# EAGLE design PICO_SDR (EAGLE 9.6.2)
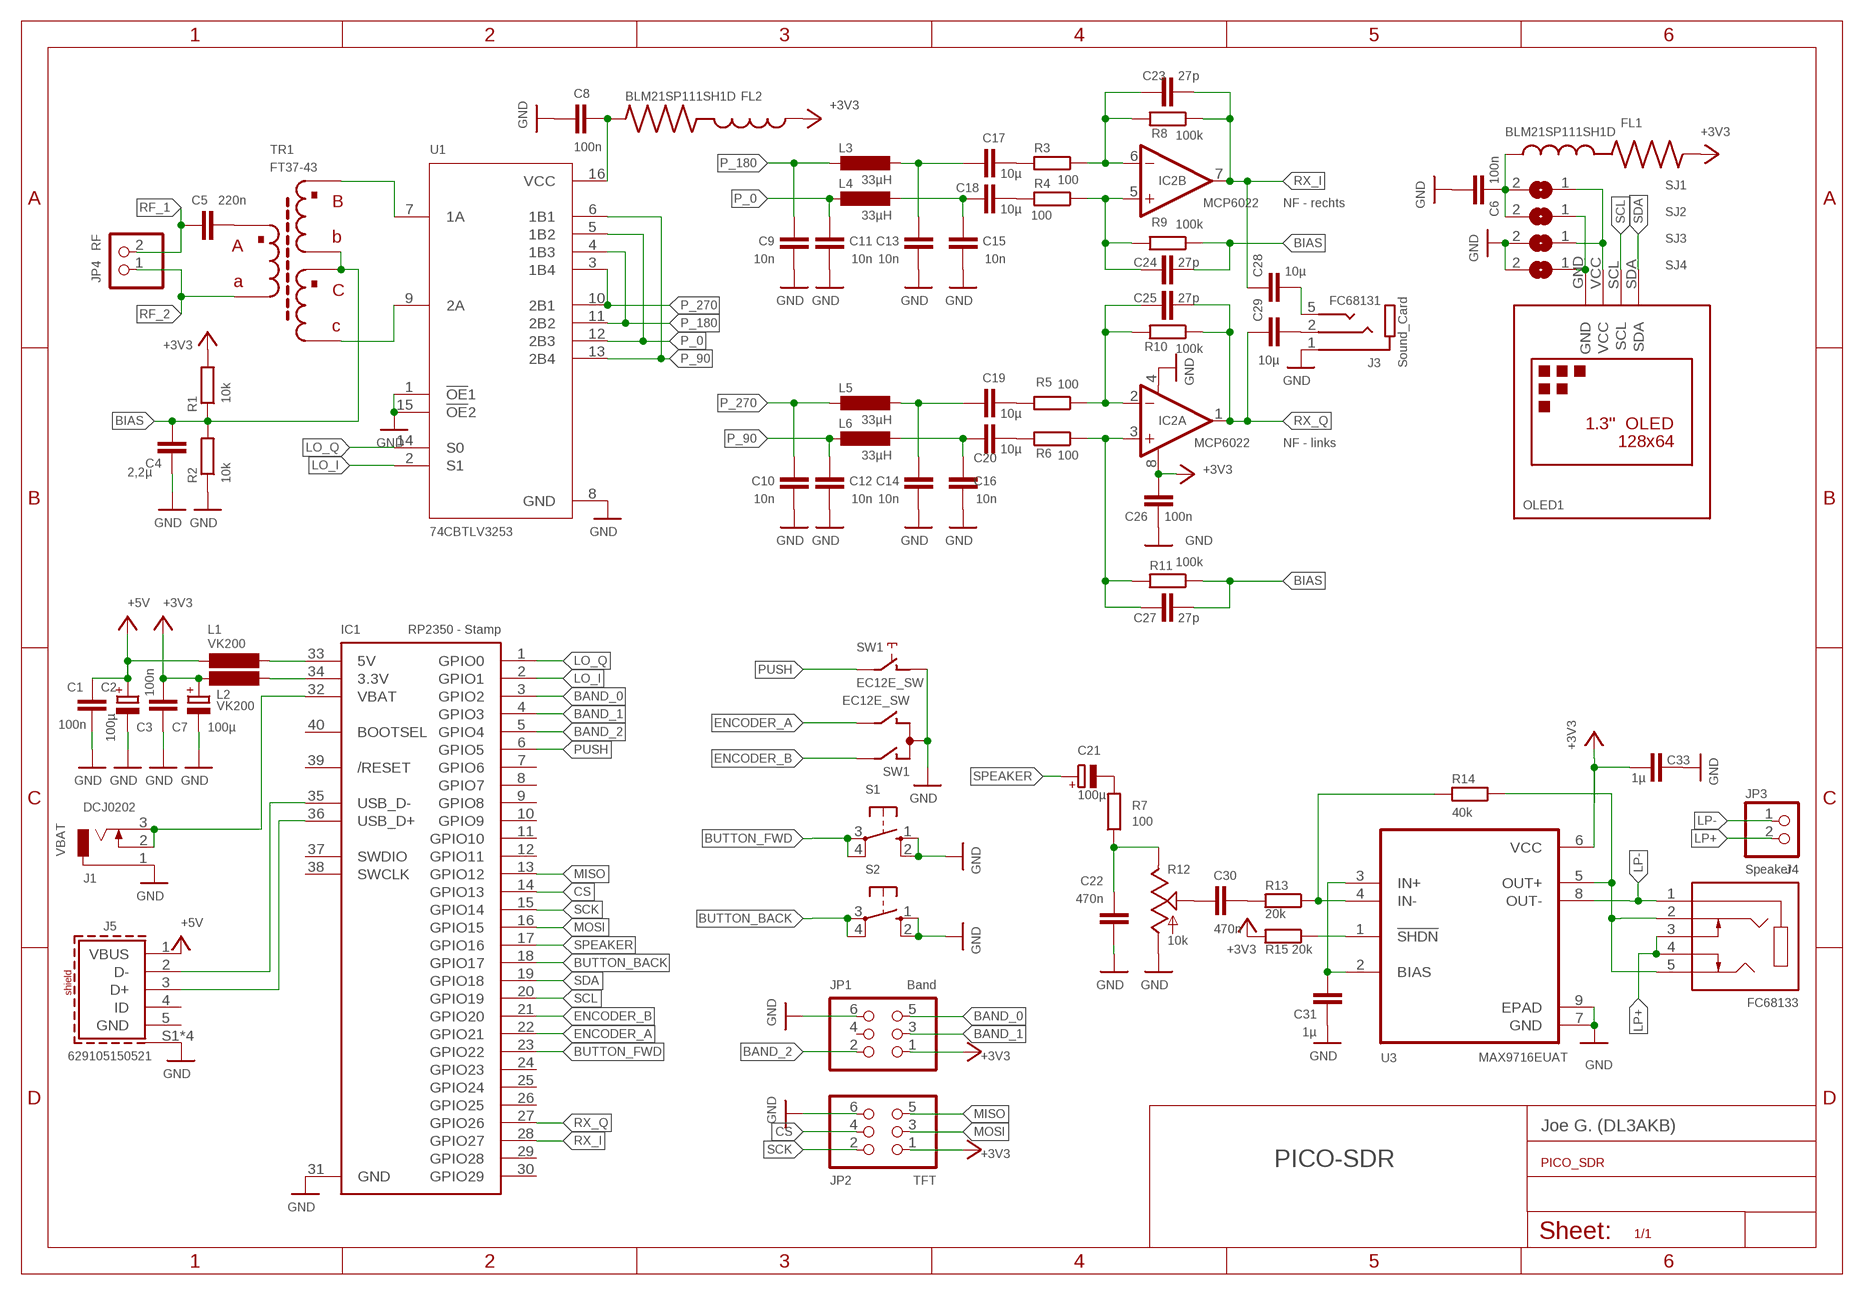
[diagram p0: schematic, sheet 1]

## Parts
C1  100n  C-EUC1206  [C1206]
C2  100µ  CPOL-EUSMCD  [SMC_D]
C3  100n  C-EUC1206  [C1206]
C4  2,2µ  C-EUC0805  [C0805]
C5  220n  C-EUC1206  [C1206]
C6  100n  C-EUC0805  [C0805]
C7  100µ  CPOL-EUSMCD  [SMC_D]
C8  100n  C-EUC0805  [C0805]
C9  10n  C-EUC0805  [C0805]
C10  10n  C-EUC0805  [C0805]
C11  10n  C-EUC0805  [C0805]
C12  10n  C-EUC0805  [C0805]
C13  10n  C-EUC0805  [C0805]
C14  10n  C-EUC0805  [C0805]
C15  10n  C-EUC0805  [C0805]
C16  10n  C-EUC0805  [C0805]
C17  10µ  C-EUC1206  [C1206]
C18  10µ  C-EUC1206  [C1206]
C19  10µ  C-EUC1206  [C1206]
C20  10µ  C-EUC1206  [C1206]
C21  100µ  CPOL-EUSMCD  [SMC_D]
C22  470n  C-EUC1206  [C1206]
C23  27p  C-EUC1206  [C1206]
C24  27p  C-EUC1206  [C1206]
C25  27p  C-EUC1206  [C1206]
C26  100n  C-EUC0805  [C0805]
C27  27p  C-EUC1206  [C1206]
C28  10µ  C-EUC1206  [C1206]
C29  10µ  C-EUC1206  [C1206]
C30  470n  C-EUC0805  [C0805]
C31  1µ  C-EUC0805  [C0805]
C33  1µ  C-EUC1206  [C1206]
FL1  BLM21SP111SH1D  [BEADC2012X105N]
FL2  BLM21SP111SH1D  [BEADC2012X105N]
IC1  RP2350 - Stamp  RP2040_STAMPSMD  [RP2XXX_STAMP_SMD]
IC2  MCP6022  OPA2237U  [SO08]
J1  DCJ0202  [DCJ0202]
J3  FC68131  [CLIFF_FC68131]
J4  FC68133  [CLIFF_FC68133]
J5  629105150521  [629105150521]
JP1  Band  PINHD-2X3  [2X03]
JP2  TFT  PINHD-2X3  [2X03]
JP3  Speaker  PINHD-1X2  [1X02]
JP4  RF  PINHD-1X2  [1X02]
L1  VK200  L-EU0207/5V  [0207/5V]
L2  VK200  L-EU0207/5V  [0207/5V]
L3  33µH  L-EUL1812  [L1812]
L4  33µH  L-EUL1812  [L1812]
L5  33µH  L-EUL1812  [L1812]
L6  33µH  L-EUL1812  [L1812]
OLED1  OLED  [1.3]
R1  10k  R-EU_R0805  [R0805]
R2  10k  R-EU_R0805  [R0805]
R3  100  R-EU_R0805  [R0805]
R4  100  R-EU_R0805  [R0805]
R5  100  R-EU_R0805  [R0805]
R6  100  R-EU_R0805  [R0805]
R7  100  R-EU_R0805  [R0805]
R8  100k  R-EU_R0805  [R0805]
R9  100k  R-EU_R0805  [R0805]
R10  100k  R-EU_R0805  [R0805]
R11  100k  R-EU_R0805  [R0805]
R12  10k  RK09K1130A6S  [RK09K1130A6S]
R13  20k  R-EU_R0805  [R0805]
R14  40k  R-EU_R0805  [R0805]
R15  20k  R-EU_R0805  [R0805]
S1  10-XX  [B3F-10XX]
S2  10-XX  [B3F-10XX]
SJ1  SJ  [SJ]
SJ2  SJ  [SJ]
SJ3  SJ  [SJ]
SJ4  SJ  [SJ]
SW1  EC12E_SW  [ALPS_EC12E_SW]
TR1  FT37-43  [FT37-43]
U1  74CBTLV3253  FST3253MX  [SOIC127P599X175-16N]
U3  MAX9716EUAT  [SOP65P490X110-9N]

## Nets
+3V3: C3.2 C7.+ C26.2 C33.2 FL1.2 FL2.1 IC2.8(A:V+) JP1.1 JP2.1 L2.2 R1.2 R15.2 U3.6(VCC)
+5V: C1.2 C2.+ J5.1(VBUS) L1.2
BAND_0: IC1.3(GPIO2) JP1.5
BAND_1: IC1.4(GPIO3) JP1.3
BAND_2: IC1.5(GPIO4) JP1.2
BIAS: C4.2 C24.2 C27.2 R1.1 R2.2 R9.1 R11.1 TR1.P$3 TR1.P$5
BUTTON_BACK: IC1.18(GPIO17) S2.3(P) S2.4(P1)
BUTTON_FWD: IC1.23(GPIO22) S1.3(P) S1.4(P1)
CS: IC1.14(GPIO13) JP2.4
D+: IC1.36(USB_D+) J5.3(D+)
D-: IC1.35(USB_D-) J5.2(D-)
ENCODER_A: IC1.22(GPIO21) SW1.B
ENCODER_B: IC1.21(GPIO20) SW1.A
GND: C1.1 C2.- C3.1 C4.1 C6.2 C7.- C8.2 C9.1 C10.1 C11.1 C12.1 C13.1 C14.1 C15.1 C16.1 C22.1 C26.1 C31.1 C33.1 IC1.31(GND) IC2.4(A:V-) J1.1 J3.1(SLEEVE) J5.S1(SHIELD) J5.S2(SHIELD) J5.S3(SHIELD) J5.S4(SHIELD) JP1.6 JP2.6 R2.1 R12.E S1.1(S) S1.2(S1) S2.1(S) S2.2(S1) SJ3.2 SJ4.2 SW1.C SW1.D U1.1(!OE!1) U1.8(GND) U1.15(!OE!2) U3.7(GND) U3.9(EPAD)
LO_I: IC1.2(GPIO1) U1.2(S1)
LO_Q: IC1.1(GPIO0) U1.14(S0)
LP+: J4.3 J4.4 JP3.2
LP-: J4.1 JP3.1 U3.8(OUT-)
MISO: IC1.13(GPIO12) JP2.5
MOSI: IC1.16(GPIO15) JP2.3
N$1: IC1.34(3.3V) L2.1
N$2: C21.- R7.2
N$3: C16.2 C20.1 L6.2
N$4: IC1.33(5V) L1.1
N$5: TR1.P$6 U1.9(2A)
N$6: C19.2 R5.2
N$7: TR1.P$2 U1.7(1A)
N$8: R13.1 R14.2 U3.4(IN-)
N$9: C30.2 R12.S
N$10: C27.1 IC2.3(A:+IN) R6.1 R11.2
N$11: C25.1 IC2.2(A:-IN) R5.1 R10.2
N$12: C18.2 R4.2
N$13: C23.1 IC2.6(B:-IN) R3.1 R8.2
N$14: C31.2 U3.2(BIAS) U3.3(IN+)
N$15: C17.2 R3.2
N$16: C24.1 IC2.5(B:+IN) R4.1 R9.2
N$17: C30.1 R13.2
N$18: C5.2 TR1.P$1
N$19: C20.2 R6.2
N$20: C15.2 C18.1 L4.2
N$21: C28.2 J3.5(TIP)
N$22: C29.2 J3.2(RING)
N$23: OLED1.GND SJ2.1 SJ4.1
N$24: OLED1.VCC SJ1.1 SJ3.1
N$25: R15.1 U3.1(!SHDN)
N$26: C13.2 C17.1 L3.2
N$27: C14.2 C19.1 L5.2
N$28: C6.1 FL1.1 SJ1.2 SJ2.2
N$29: C8.1 FL2.2 U1.16(VCC)
NF: C22.2 R7.1 R12.A
OUT_R: J4.2 J4.5 R14.1 U3.5(OUT+)
P_0: C11.2 L4.1 U1.5(1B2) U1.12(2B3)
P_90: C12.2 L6.1 U1.6(1B1) U1.13(2B4)
P_180: C9.2 L3.1 U1.4(1B3) U1.11(2B2)
P_270: C10.2 L5.1 U1.3(1B4) U1.10(2B1)
PUSH: IC1.6(GPIO5) SW1.E
RF_1: C5.1 JP4.2
RF_2: JP4.1 TR1.P$4
RX_I: C23.2 C28.1 IC1.28(GPIO27) IC2.7(B:OUT) R8.1
RX_Q: C25.2 C29.1 IC1.27(GPIO26) IC2.1(A:OUT) R10.1
SCK: IC1.15(GPIO14) JP2.2
SCL: IC1.20(GPIO19) OLED1.SCL
SDA: IC1.19(GPIO18) OLED1.SDA
SPEAKER: C21.+ IC1.17(GPIO16)
VBAT: IC1.32(VBAT) J1.2 J1.3
Unconnected: IC1.7(GPIO6) IC1.8(GPIO7) IC1.9(GPIO8) IC1.10(GPIO9) IC1.11(GPIO10) IC1.12(GPIO11) IC1.24(GPIO23) IC1.25(GPIO24) IC1.26(GPIO25) IC1.29(GPIO28) IC1.30(GPIO29) IC1.37(SWDIO) IC1.38(SWCLK) IC1.39(/RESET) IC1.40(BOOTSEL) J5.4(ID) J5.5(GND) JP1.4 SW1.GND1(G) SW1.GND2(G)

## Notes on the sheet
- NF - rechts
- Sound_Card
- NF - links
- Joe G. (DL3AKB)
- PICO-SDR

## Library data of the parts
C1 C3-C6 C8-C20 C22-C31 C33 = rcl:C-EU: CAPACITOR, European symbol; SPICEPREFIX: C
C2 C7 C21 = rcl:CPOL-EU: POLARIZED CAPACITOR, European symbol; SPICEPREFIX: C
FL1 FL2 = BLM21SP111SH1D:BLM21SP111SH1D: Check availability <https://pricing.snapeda.com/parts/BLM21SP111SH1D/Murata/view-part?ref=eda>; AVAILABILITY: In Stock; CHECK_PRICES: https://www.snapeda.com/parts/BLM21SP111SH1D/Murata/view-part/?ref=eda; DESCRIPTION: Ferrite Beads Multi-Layer Power 110Ohm 25% 100MHz 5A 0.013Ohm DCR 0805 Automotive T/R; MF: Murata; MP: BLM21SP111SH1D; PACKAGE: 2012 Murata; PRICE: None; SNAPEDA_LINK: https://www.snapeda.com/parts/BLM21SP111SH1D/Murata/view-part/?ref=snap
IC1 = rp2xxx_stamp:RP2040_STAMP
IC2 = burr-brown:OPA2237: Single-Supply Operational Amplifiers MicroAmplifier(TM) Series; Product Folder:OPA2237; MF: TEXAS INSTRUMENTS; MPN: OPA2237UA; OC_FARNELL: 1388075; OC_NEWARK: 80K6018
J1 = con-jack:DCJ0202: DC POWER JACK Source: DCJ0202.pdf; OC_FARNELL: unknown; OC_NEWARK: unknown
J3 = FC68131:FC68131: Check availability <https://pricing.snapeda.com/parts/FC68131/Cliff/view-part?ref=eda>; AVAILABILITY: In Stock; CHECK_PRICES: https://www.snapeda.com/parts/FC68131/Cliff+Electronic+Components/view-part/?ref=eda; DESCRIPTION: 3.50mm (0.141, 1/8, Mini Plug) - Headphone Phone Jack Stereo (3 Conductor, TRS) Connector Solder; MF: Cliff; MP: FC68131; PACKAGE: None; PRICE: None; SNAPEDA_LINK: https://www.snapeda.com/parts/FC68131/Cliff+Electronic+Components/view-part/?ref=snap
J4 = FC68133:FC68133: Check availability <https://pricing.snapeda.com/parts/FC68133/Cliff/view-part?ref=eda>; AVAILABILITY: In Stock; CHECK_PRICES: https://www.snapeda.com/parts/FC68133/Cliff+Electronic+Components/view-part/?ref=eda; DESCRIPTION: 3.50mm (0.141, 1/8, Mini Plug) - Headphone Phone Jack Stereo (3 Conductor, TRS) Connector Solder; MF: Cliff; MP: FC68133; PACKAGE: None; PRICE: None; SNAPEDA_LINK: https://www.snapeda.com/parts/FC68133/Cliff+Electronic+Components/view-part/?ref=snap
J5 = Eagle_WR-USB (rev25a):629105150521: WR-COM Micro USB 2.0 SMT Type B Horizontal 5 Contacts High Current Kind Properties Durability:10 000 Mating cycles Quality Class:10 000 Mating cycles Connector Type:Micro USB Gender:Receptacle Type:Horizontal General Information Operating Temperature:-40up to +105 °C Compliance:RoHS Electrical Properties IR 1:3A Working Voltage:30V (AC) Withstanding Voltage:100V (AC) Contact Resistance:30 mΩ Material Properties Insulator Material:LCP Insulator Flammability Rating:UL94 V-0 Color:Black Contact Material:Copper Alloy Contact Plating: Gold Contact Type:Stamped Shielding Material:Stainless Steel Shielding Plating:Nickel <https://www.we-online.com/catalog/media/o86333v209%20WR-COM_629105150521_family.jpg> Details see: www.we-online.com/en/components/products/COM_MICRO_SMT_TYPE_B_HORIZONTAL_HIGH_CURRENT <www.we-online.com/catalog/COM_MICRO_SMT_TYPE_B_HORIZONTAL_HIGH_CURRENT/?utm_source=eagle_model&utm_medium=description_link&utm_campaign=eisos_eagle> Updated by Ella Wu 2023-05-30 2023 (C) Würth Elektronik; APPLICATION: Micro USB 2.0; DATASHEET-URL: https://www.we-online.com/redexpert/spec/629105150521?ae; GERDER: Receptacle; INTERFACE-TYPE: Type B; MOUNT: SMT; PACKAGING: Tape and Reel; PART-NUMBER: 629105150521; PINS: 5; TYPE: Horizontal; WORKING-VOLTAGE: 30V(AC)
JP1 JP2 = pinhead:PINHD-2X3: PIN HEADER
JP3 JP4 = pinhead:PINHD-1X2: PIN HEADER
L1-L6 = rcl:L-EU: INDUCTOR, European symbol; SPICEPREFIX: L
OLED1 = 13oled:OLED
R1-R11 R13-R15 = rcl:R-EU_: RESISTOR, European symbol; SPICEPREFIX: R
R12 = RK09K1130A6S:RK09K1130A6S: Check availability <https://pricing.snapeda.com/parts/RK09K1130A6S/ALPS/view-part?ref=eda>; AVAILABILITY: In Stock; CHECK_PRICES: https://www.snapeda.com/parts/RK09K1130A6S/ALPS/view-part/?ref=eda; DESCRIPTION: 10k Ohm 1 Gang Linear Through Hole, Snap In Potentiometer None 1.0 Kierros 0.05W, 1/20W PC Pins; MF: ALPS; MP: RK09K1130A6S; PACKAGE: None; PRICE: None; SNAPEDA_LINK: https://www.snapeda.com/parts/RK09K1130A6S/ALPS/view-part/?ref=snap
S1 S2 = switch-omron:10-XX: OMRON SWITCH; MPN: B3F-1000; OC_FARNELL: 176432; OC_NEWARK: 36M3542
SJ1-SJ4 = jumper:SJ: SMD solder JUMPER
SW1 = switch-alps:EC12E_SW: ALPS rotary Encoder EC12E series with switch; MPN: EC12E2424407; OC_FARNELL: 1520813; OC_NEWARK: 74M1068
TR1 = AMESYS_neu:FT37-43
U1 = FST3253MX:FST3253MX: Check availability <https://pricing.snapeda.com/parts/FST3253MX/ON%20Semiconductor/view-part?ref=eda>; AVAILABILITY: In Stock; CHECK_PRICES: https://www.snapeda.com/parts/FST3253MX/Onsemi/view-part/?ref=eda; DESCRIPTION: Multiplexer/Demultiplexer 2 x 4:1 16-SOIC; MF: ON Semiconductor; MP: FST3253MX; PACKAGE: SOIC-16 ON Semiconductor; PRICE: None; SNAPEDA_LINK: https://www.snapeda.com/parts/FST3253MX/Onsemi/view-part/?ref=snap
U3 = MAX9716EUAT:MAX9716EUAT: Check availability <https://pricing.snapeda.com/parts/MAX9716EUA%2B/Analog%20Devices/view-part?ref=eda>; AVAILABILITY: In Stock; CHECK_PRICES: https://www.snapeda.com/parts/MAX9716EUA+/Analog+Devices/view-part/?ref=eda; DESCRIPTION: Low-Cost, Mono, 1.4W BTL Audio Power Amplifiers; MF: Analog Devices; MP: MAX9716EUA+; PACKAGE: MICRO MAX-EP-8 Maxim; PRICE: None; SNAPEDA_LINK: https://www.snapeda.com/parts/MAX9716EUA+/Analog+Devices/view-part/?ref=snap

## Board
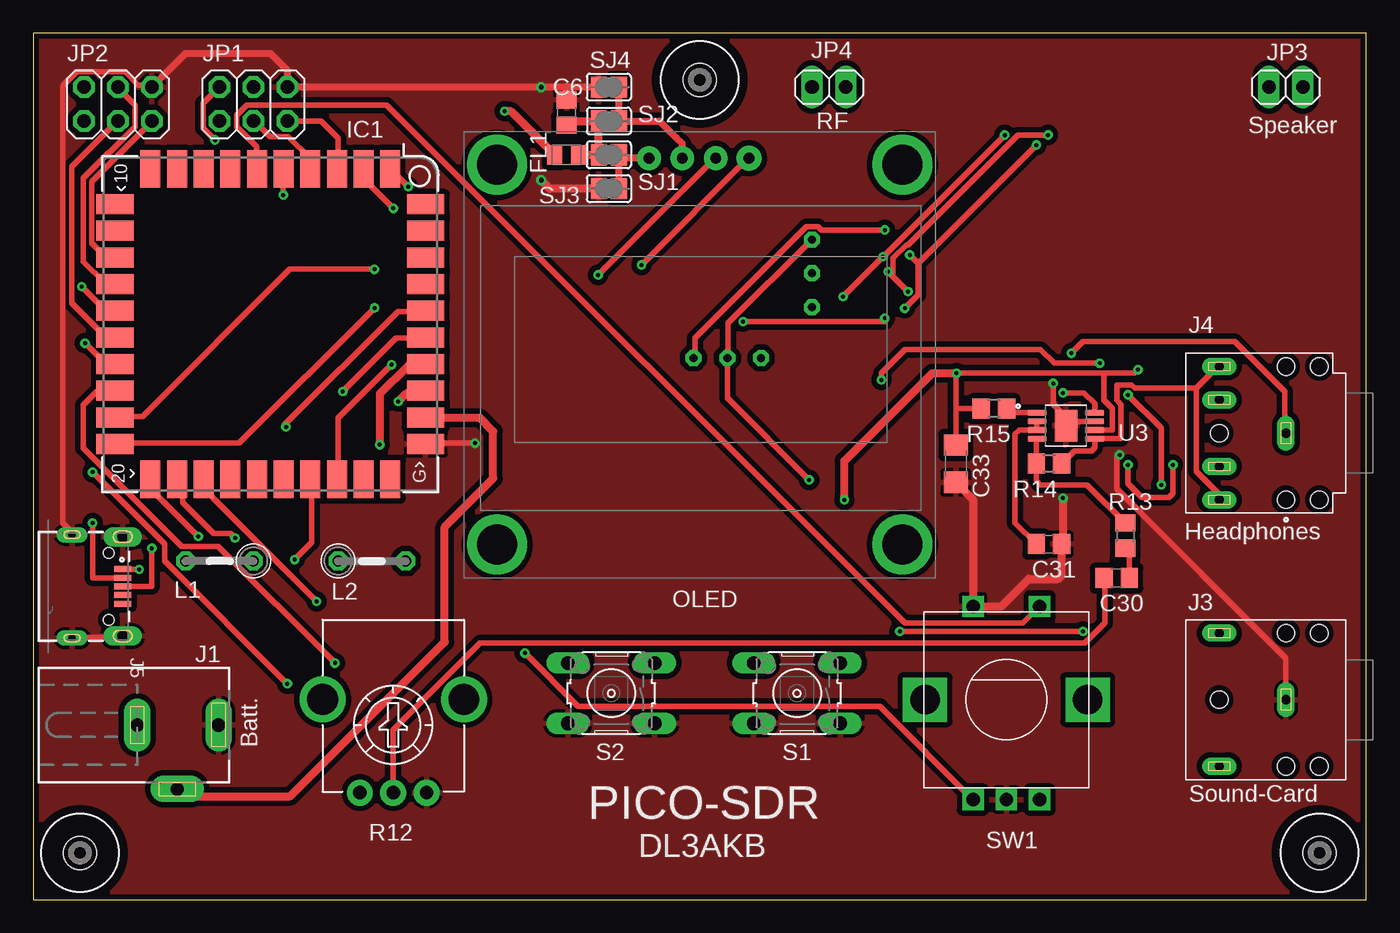
[diagram p1: board, top side]
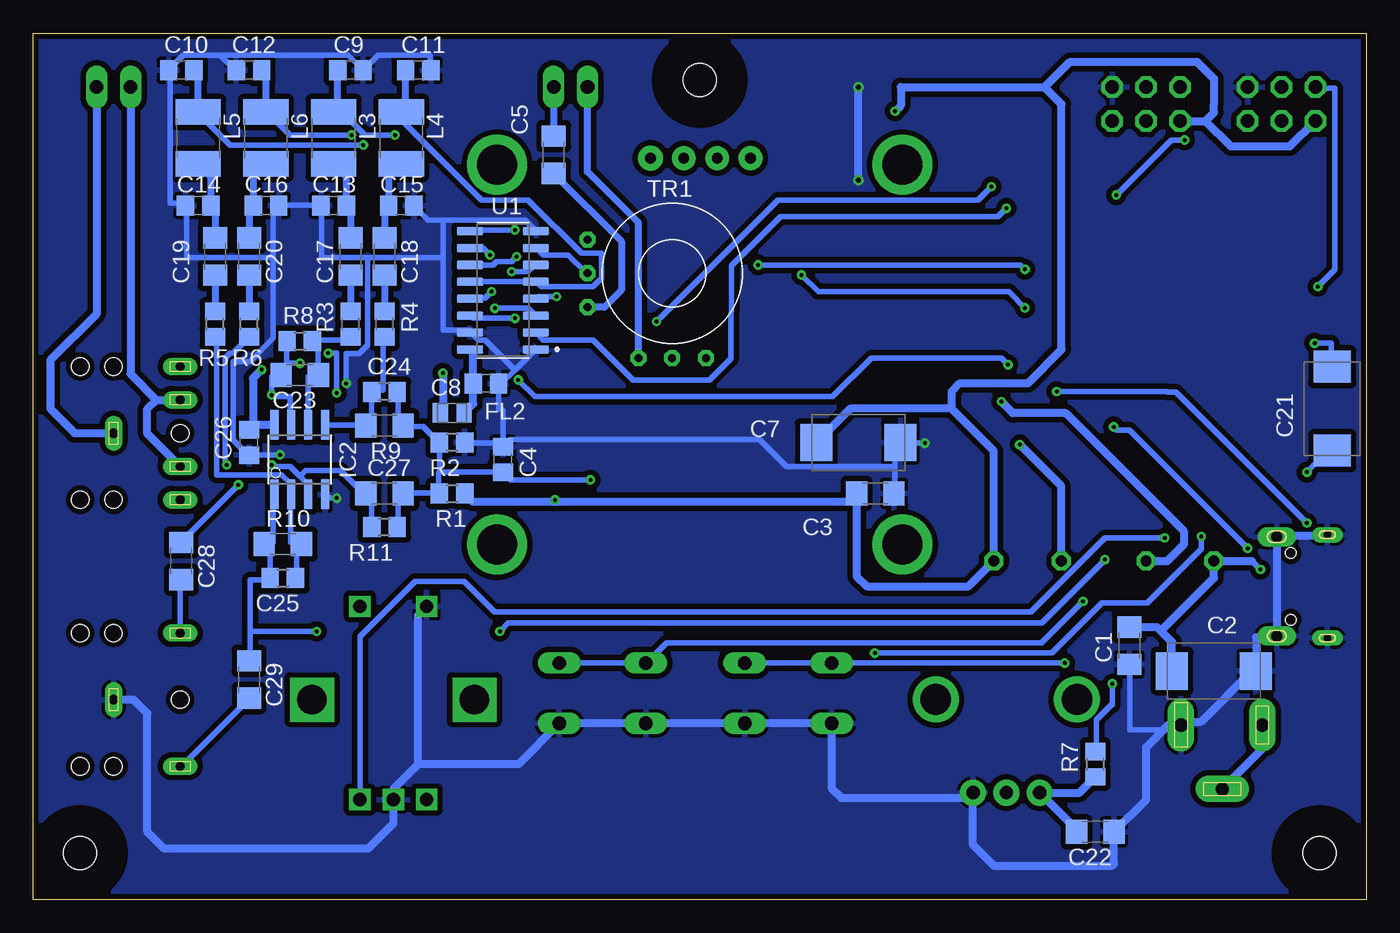
[diagram p2: board, bottom side, seen from below]

Size 100 x 65 mm. Coordinates in mm from the lower left corner, seen from the top.
Outline: 0,0 100,0 100,65 0,65 0,0
Copper layers (1*16): Top 0.035mm / dielectric 1.5mm / Bottom 0.035mm
Design rules "aisler_2_layer_simple *": minimum track width 16mil, minimum drill 0.3mm, track to track 0.15mm, track to pad 0.15mm, pad to pad 0.15mm, via to via 0.15mm, smd to smd 0mil, copper to edge 0.3mm, drill to drill 0.3mm, minimum pad ring 0.3mm, minimum via ring 0.2mm, stop-mask expansion 0mil, vias tented up to drill 0mil, thermal gap 10mil

### Footprints (pad centres in the part's own frame; a part is rotated, then mirrored left to right if it is on the bottom)
C1206 = smd 1.6 x 1.8: 1 -1.4,0; 2 1.4,0
SMC_D = smd 2.4 x 2.8: + -3.15,0; - 3.15,0
C0805 = smd 1.3 x 1.5: 1 -0.95,0; 2 0.95,0
BEADC2012X105N = smd 1.14 x 1.47: 1 -0.89,0; 2 0.89,0
RP2XXX_STAMP_SMD = smd 2.8 x 1.5: 1 -11.65,9; 2 -11.65,7; 3 -11.65,5; 4 -11.65,3; 5 -11.65,1; 6 -11.65,-1; 7 -11.65,-3; 8 -11.65,-5; 9 -11.65,-7; 10 -11.65,-9; 21 11.65,-9; 22 11.65,-7; 23 11.65,-5; 24 11.65,-3; 25 11.65,-1; 26 11.65,1; 27 11.65,3; 28 11.65,5; 29 11.65,7; 30 11.65,9 | smd 1.5 x 2.8: 11 -9,-11.65; 12 -7,-11.65; 13 -5,-11.65; 14 -3,-11.65; 15 -1,-11.65; 16 1,-11.65; 17 3,-11.65; 18 5,-11.65; 19 7,-11.65; 20 9,-11.65; 31 9,11.65; 32 7,11.65; 33 5,11.65; 34 3,11.65; 35 1,11.65; 36 -1,11.65; 37 -3,11.65; 38 -5,11.65; 39 -7,11.65; 40 -9,11.65
SO08 = smd 0.61 x 2.21: 1 -1.905,-2.616; 2 -0.635,-2.616; 3 0.635,-2.616; 4 1.905,-2.616; 5 1.905,2.616; 6 0.635,2.616; 7 -0.635,2.616; 8 -1.905,2.616
DCJ0202 = drill 1 pad 2 long: 1 0,3.1; 2 4.8,0; 3 0,-3
CLIFF_FC68131 = drill 0.7 long: 1 0,0; 2 5,5; 5 5,-5 | hole 1.3: 5,0; 0,-5; 0,5; -2.5,5; -2.5,-5
CLIFF_FC68133 = drill 0.7 long: 1 0,0; 2 5,5; 3 5,2.5; 4 5,-2.5; 5 5,-5 | hole 1.3: 5,0; 0,5; -2.5,5; 0,-5; -2.5,-5
629105150521 = smd 0.45 x 1.3: 1 -1.3,2.9; 2 -0.65,2.9; 3 0,2.9; 4 0.65,2.9; 5 1.3,2.9 | drill 0.85 pad 1 long: S1 -3.725,2.9; S2 3.725,2.9 | drill 0.55 pad 0.9 long: S3 3.875,-0.9; S4 -3.875,-0.9 | hole 0.8: -2.5,1.85; 2.5,1.85
2X03 = drill 1.016 octagon: 1 -2.54,-1.27; 2 -2.54,1.27; 3 0,-1.27; 4 0,1.27; 5 2.54,-1.27; 6 2.54,1.27
1X02 = drill 1.016 long: 1 -1.27,0; 2 1.27,0
0207/5V = drill 0.813 octagon: 1 -2.54,0; 2 2.54,0
L1812 = smd 1.9 x 3.4: 1 -1.95,0; 2 1.95,0
1.3 = drill 0.8 pad 1.778: GND 16.39,31.5; SCL 18.89,31.5; VCC 13.89,31.5 | drill 3: P$1 2.5,2.5; P$2 32.9,2.5; P$3 2.5,31; P$4 32.9,31 | drill 0.8 pad 1.9: SDA 21.39,31.5
R0805 = smd 1.3 x 1.5: 1 -0.95,0; 2 0.95,0
RK09K1130A6S = drill 1 pad 1.93: A -2.5,-6.985; E 2.5,-6.985; S 0,-6.985 | drill 2.3 pad 3: P$1 -5.3,0.015; P$2 5.3,0.015
B3F-10XX = drill 1.016 long: 1 -3.251,2.261; 2 3.251,2.261; 3 -3.251,-2.261; 4 3.251,-2.261
SJ = smd 1.168 x 1.6: 1 -0.762,0; 2 0.762,0
ALPS_EC12E_SW = drill 1 square: A -2.5,-7.5; B 2.5,-7.5; C 0,-7.5; D -2.5,7; E 2.5,7 | drill 2.2 square: GND1 -6.1,0; GND2 6.1,0
FT37-43 = drill 0.6 octagon: P$1 -2.54,6.35; P$2 0,6.35; P$3 2.54,6.35; P$4 -6.35,2.54; P$5 -6.35,0; P$6 -6.35,-2.54
SOIC127P599X175-16N = smd 1.97 x 0.6: 1 -2.47,4.445; 2 -2.47,3.175; 3 -2.47,1.905; 4 -2.47,0.635; 5 -2.47,-0.635; 6 -2.47,-1.905; 7 -2.47,-3.175; 8 -2.47,-4.445; 9 2.47,-4.445; 10 2.47,-3.175; 11 2.47,-1.905; 12 2.47,-0.635; 13 2.47,0.635; 14 2.47,1.905; 15 2.47,3.175; 16 2.47,4.445
SOP65P490X110-9N = smd 1.42 x 0.47: 1 -2.165,0.975; 2 -2.165,0.325; 3 -2.165,-0.325; 4 -2.165,-0.975; 5 2.165,-0.975; 6 2.165,-0.325; 7 2.165,0.325; 8 2.165,0.975 | smd 1.69 x 2.362: 9 0,0
DRIL-2,5 = hole 2.5: 0,0

### Placement (x,y rotation side)
C1  17.78,19.05 90 bottom
C2  11.43,17.14 0 bottom
C3  36.83,30.48 180 bottom
C4  64.77,33.02 270 bottom
C5  60.96,55.88 270 bottom
C6  40.01,59.05 90 top
C7  38.1,34.29 0 bottom
C8  66.04,38.73 0 bottom
C9  76.2,62.23 180 bottom
C10  88.9,62.23 0 bottom
C11  71.12,62.23 180 bottom
C12  83.82,62.23 0 bottom
C13  77.47,52.07 0 bottom
C14  87.63,52.07 0 bottom
C15  72.39,52.07 180 bottom
C16  82.55,52.07 180 bottom
C17  76.2,48.26 270 bottom
C18  73.66,48.26 270 bottom
C19  86.36,48.26 270 bottom
C20  83.82,48.26 270 bottom
C21  2.54,36.83 270 bottom
C22  20.32,5.08 180 bottom
C23  80.01,39.37 180 bottom
C24  73.66,35.56 0 bottom
C25  81.28,26.67 180 bottom
C26  83.82,34.29 90 bottom
C27  73.66,30.48 0 bottom
C28  88.9,25.4 270 bottom
C29  83.82,16.51 270 bottom
C30  81.28,24.13 180 top
C31  76.2,26.67 180 top
C33  69.22,32.7 90 top
FL1  40.01,55.88 180 top
FL2  68.58,36.51 0 bottom
IC1  17.78,43.18 270 top
IC2  80.01,33.02 0 bottom
J1  10.79,13.1 270 top
J3  93.98,15 180 top
J4  93.98,35 180 top
J5  3.81,23.5 270 top
JP1  16.51,59.69 0 top
JP2  6.35,59.69 0 top
JP3  93.98,60.96 180 top
JP4  59.69,60.96 0 top
L1  13.97,25.4 180 top
L2  25.4,25.4 0 top
L3  77.47,57.15 270 bottom
L4  72.39,57.15 270 bottom
L5  87.63,57.15 270 bottom
L6  82.55,57.15 270 bottom
OLED1  32.3,24.13 0 top
R1  68.58,30.48 0 bottom
R2  68.58,34.29 180 bottom
R3  76.2,43.18 90 bottom
R4  73.66,43.18 90 bottom
R5  86.36,43.18 90 bottom
R6  83.82,43.18 90 bottom
R7  20.32,10.16 90 bottom
R8  80.01,41.91 0 bottom
R9  73.66,38.1 180 bottom
R10  81.28,24.13 0 bottom
R11  73.66,27.94 180 bottom
R12  27,15 0 top
R13  81.92,27.3 270 top
R14  76.2,32.7 180 top
R15  72.07,36.83 180 top
S1  57.3,15.48 180 top
S2  43.36,15.48 180 top
SJ1  43.18,55.88 180 top
SJ2  43.18,58.42 180 top
SJ3  43.18,53.34 180 top
SJ4  43.18,60.96 180 top
SW1  73,15 0 top
TR1  52.07,46.99 90 bottom
U1  64.77,45.72 180 bottom
U3  77.47,35.56 0 top
U$8  [DRIL-2,5]  3.5,3.5 0 top
U$9  [DRIL-2,5]  96.5,3.5 0 top
U$10  [DRIL-2,5]  50,61.5 0 top

### Tracks (layer width: path | path; a pad name or v marks a point on that pad's centre or on a via)
+3V3  (via drill 0.3)
  Top 0.406: v82.88,39.76 82.61,39.5 80.33,39.5 | v69.27,39.5 70.48,39.5 | 70.48,39.5 69.22,39.5 69.22,36.83 | 70.48,39.5 73.03,39.5 80.33,39.5 | U3.6 79.69,35.24 80.96,35.24 80.96,36.83 80.33,37.47 80.33,39.37 80.33,39.5 | C33.2 69.22,36.83 | R15.2 69.22,36.83
  Top 0.61: v60.85,29.99 60.85,32.91 67.44,39.5 v69.27,39.5 | FL1.2 35.84,59.16 v35.35,59.16
  Bottom 0.406: 83.38,35.62 | 83.38,35.62 83.75,35.25 C26.2 | 82,35.62 IC2.8 | 83.51,35.75 83.38,35.62 | C3.2 38.84,29.86 | R1.2 67.02,29.86 | v60.85,29.99 60.98,29.86
  Bottom 0.61: 82,35.62 82.88,35.62 83.38,35.62 | v82.88,39.76 83.51,39.12 83.51,35.75 | 38.84,29.86 60.98,29.86 61.49,29.86 62.12,29.86 67.02,29.86 | C3.2 38.23,24.26 37.47,23.5 29.84,23.5 L2.2 27.94,33.66 31.11,36.83 | 31.11,36.83 38.71,36.83 C7.+ | 31.11,36.83 31.11,38.1 30.46,38.75 25.41,38.75 25.4,38.73 22.86,41.27 22.86,59.69 24.13,60.96 | v35.35,59.16 34.92,59.58 34.92,60.96 24.13,60.96 | 24.13,60.96 22.23,62.87 12.7,62.87 11.43,61.59 11.43,59.69 11.43,59.05 12.06,58.42 | JP1.1 12.06,58.42 | JP2.1 5.71,56.52 10.16,56.52 12.06,58.42 | FL2.1 69.22,36.77 69.22,39.5 v69.27,39.5
+5V  (via drill 0.3)
  Top 0.406: v7.94,24.77 6.99,24.77 J5.1
  Bottom 0.406: 8.57,25.4 v7.94,24.77 | 15.69,20.45 15.56,20.32
  Bottom 0.61: 8.57,25.4 L1.2 11.43,24.13 15.4,20.16 | 15.56,20.32 15.4,20.16 | 15.4,20.16 14.58,19.34 C2.+ | C1.2 15.69,20.45
BAND_0
  Top 0.406: JP1.5 21.59,58.42 22.86,57.15 22.86,54.91 IC1.3
BAND_1
  Top 0.406: IC1.4 20.75,54.88 20.75,55.62 19.12,57.25 17.75,57.25 16.62,58.38 JP1.3
BAND_2  (via drill 0.3)
  Top 0.406: v18.75,52.88 18.75,54.75 IC1.5 | v13.62,57 12.75,57.88 12.75,59.75 13.88,60.88 JP1.2
  Bottom 0.406: v18.75,52.88 14.62,57 v13.62,57
BIAS  (via drill 0.3)
  Top 0.406: TR1.P$3 58.38,49.5 52.12,43.25 52.12,40.75 TR1.P$5 52.07,37.63 v58.21,31.49
  Bottom 0.406: R9.1 72.62,38 72.62,35.75 72.25,35.75 C24.2 72.25,35.5 70.75,35.5 69.62,34.38 R2.2 69.5,34.12 69.53,34.09 69.53,32.07 | 69.6,30.49 69.62,30.5 72.25,30.5 C27.2 72.38,30.38 72.62,30.38 72.62,28 R11.1 | 69.6,30.49 R1.1 | C4.2 | C4.2 64.19,31.49 v58.21,31.49 | C4.2 69.53,32.07 | 69.6,30.49 69.6,32 69.53,32.07
BUTTON_BACK  (via drill 0.3)
  Top 0.406: v22.62,17.75 13.88,26.5 11.12,26.5 3.74,33.88 3.74,37.12 4.74,38.12 6.12,38.12 IC1.18
  Bottom 0.406: v22.62,17.75 40,17.75 S2.4 40.25,17.75 46.5,17.75 S2.3
BUTTON_FWD  (via drill 0.3)
  Top 0.406: v21.25,22.38 12.88,30.75 12.88,31.5 IC1.23
  Bottom 0.406: v21.25,22.38 24.38,19.25 52.5,19.25 54,17.75 S1.4 54.25,17.75 60.5,17.75 S1.3
CS
  Top 0.406: IC1.14 6.12,46.25 5.38,46.25 3.75,47.88 3.75,54.12 7.62,58 7.62,59.62 6.38,60.88 JP2.4
D+  (via drill 0.3)
  Top 0.406: v18.95,35.47 18.82,35.59 27.36,44.12 29.38,44.12 IC1.36 | v8.89,26.35 8.89,23.5 6.99,23.5 J5.3
  Bottom 0.406: v8.89,26.35 17.78,35.24 18.73,35.24 v18.95,35.47
D-  (via drill 0.3)
  Top 0.406: v23.22,38.12 27.23,42.12 29.38,42.12 IC1.35 | v4.45,28.26 4.45,24.13 6.67,24.13 J5.2
  Bottom 0.406: v23.22,38.12 14.99,38.12 14.92,38.1 14.29,38.1 v4.45,28.26
ENCODER_A  (via drill 0.3)
  Top 0.406: v15.12,27.14 14.81,27.45 13.54,27.45 11.19,29.8 11.19,31.4 IC1.22
  Bottom 0.406: v15.12,27.14 19.61,27.14 25.16,21.59 65.41,21.59 67.7,23.89 71.38,23.89 75.5,19.76 SW1.B
ENCODER_B  (via drill 0.3)
  Top 0.406: v12.38,27.25 8.88,30.75 8.88,31.5 IC1.21 | v36.88,18.5 40.88,14.5 63.5,14.5 SW1.A
  Bottom 0.406: v12.38,27.25 12.38,26.3 16.41,22.26 19.84,22.26 23.59,18.5 v36.88,18.5
GND  (via drill 0.3, 0.35)
  Top 0.406: v33.12,34.25 29.5,34.25 IC1.31 | JP2.6 8.75,61.12 7.88,61.12 6.88,62.12 3.25,62.12 2.25,61.12 2.22,60.96 2.22,28.26 2.86,27.62 J5.S4 | 77.25,29.88 77.38,30 v77.25,30.12 | 77.25,26.75 C31.1 | U3.7 77.8,35.88 77.79,35.88 | 77.79,35.88 U3.9 77.79,35.88 | J5.S3 3.17,19.68 6.67,19.68 J5.S2 | 77.79,35.88 76.52,37.15 v76.52,38.73 | v81.5,33.38 81.28,33.34 81.28,30.8 93.98,18.1 93.98,15.24 J3.1
  Top 0.508: SJ4.2 41.38,60.96 40.01,60.96 39.05,60.96 v38.1,60.96 JP1.6 19.05,62.23 17.78,63.5 11.43,63.5 JP2.6
  Top 0.61: 77.25,29.88 77.25,26.75 | C31.1 77.15,24.3 76.91,24.06 74.68,24.06 72.62,22 SW1.D 70.5,30.02 C33.1 | C6.2 40.01,60.96 | SJ3.2 38.73,53.34 v38.1,53.98
  Bottom 0.406: C11.1 70.25,62.25 70.25,63.38 74.12,63.38 75.25,62.25 C9.1 75.38,62.38 76.38,63.38 85.75,63.38 85.88,63.25 | 85.88,63.25 86,63.38 88.75,63.38 89.88,62.25 C10.1 89.75,62.12 89.75,52.25 88.62,52.25 C14.1 88.5,52 88.5,48.18 82.12,48.18 82,48.31 | 85.88,63.25 84.88,62.25 C12.1 | 82,48.31 82,48.5 82,51.88 81.62,51.88 C16.1 81.5,52.12 78.5,52.12 C13.1 78.38,51.88 78.38,48.18 74.93,48.18 | 82,48.31 82,42.12 83.75,40.38 85,40.38 85,34.5 83.88,33.38 C26.1 83.62,33.38 v81.5,33.38 | 35.38,32.5 35.38,34.25 35,34.25 C7.- 34.75,34.25 v33.12,34.25 | 35.38,32.5 35.38,30.5 C3.1 | 69.14,51 68.62,51 63.12,51 62.38,50.25 U1.8 | 69.14,51 70.38,51 71.38,52 C15.1 | C4.1 64.88,34 65.12,34.25 67.62,34.25 R2.1 | C4.1 64.77,36.67 64.76,36.68 65.09,36.79 C8.2 64.97,38.66 63.88,39.75 | 63.88,39.75 62.38,41.25 U1.1 | 63.88,39.75 64,39.88 66.12,42 66.62,42 67.12,42.5 U1.15 67.25,42.75 69.26,42.75 69.26,48.18 | 69.26,48.18 69.26,48.5 69.26,50.88 69.14,51 | C4.1 64.23,34.51 45.52,34.51 43.51,32.5 35.5,32.5 35.38,32.5 | 74.93,48.18 70.34,48.18 69.26,48.18 | v77.25,30.12 77.75,30.12 78,30.38 IC2.4 | C1.1 17.75,17.62 17.75,12.75 15.05,12.75 J1.1 | 6.67,27.3 J5.S1 6.67,26.99 | 8.26,17.14 C2.- 8.57,17.14 | v76.52,38.73 76.52,40.96 75.56,40.96 74.93,41.59 74.93,48.18
  Bottom 0.61: 71.12,10.16 63.61,10.16 S1.1 S1.2 S2.1 S2.2 40.11,8.36 39.37,7.62 29.89,7.62 R12.E 29.5,4.1 27.94,2.54 19.05,2.54 18.92,2.67 C22.1 16.51,7.49 16.51,11.43 14.85,13.1 J1.1 13.65,13.34 12.38,13.34 8.57,17.14 | 71.12,10.16 73,8.28 SW1.C 73,5.69 74.88,3.81 90.17,3.81 91.44,5.08 91.44,13.97 92.47,15 J3.1 | 71.12,10.16 71.12,21.38 SW1.D | v38.1,53.98 v38.1,60.96 | 6.67,27.3 3.17,27.3 J5.S4 | 8.26,17.14 8.26,19.68 6.99,19.68 J5.S2 6.67,20 6.67,26.99
  pour Top (isolate 0.406): 0,64.77 100.33,64.77 100.33,0 0,0
  pour Bottom (isolate 0.406): 0,64.77 100.33,64.77 100.33,-0.64 0,-0.64
LO_I  (via drill 0.3)
  Top 0.406: v27,51.88 24.88,54 24.88,54.75 IC1.2
  Bottom 0.406: v27,51.88 27.64,51.24 43.96,51.24 47.63,47.58 47.66,40.61 49.27,38.99 55,38.99 58.01,42 61.75,42 62.25,42.5 U1.2
LO_Q  (via drill 0.3)
  Top 0.406: v63.88,43.62 63.88,43.38 v53.25,43.38 | v28.12,53.5 26.88,54.75 IC1.1
  Bottom 0.406: v63.88,43.62 67,43.62 67.12,43.75 U1.14 | v53.25,43.38 44.12,52.5 29.12,52.5 v28.12,53.5
LP+
  Bottom 0.61: J4.3 91.44,34.96 91.44,36.83 90.77,37.5 | 90.77,37.5 J4.4 | JP3.2 92.71,39.44 90.77,37.5
LP-  (via drill 0.3)
  Top 0.406: v77.88,41 78.75,41.88 90.12,41.88 93.88,38.12 93.88,35 J4.1 | v77.25,38.02 78.82,38.02 79.64,37.2 U3.8
  Bottom 0.406: v77.25,38.02 77.25,41 v77.88,41
  Bottom 0.61: JP3.1 95.25,43.95 98.73,40.47 98.73,36.83 96.9,35 J4.1
MISO
  Top 0.406: IC1.13 6.12,48.25 5.38,48.25 4.38,49.25 4.38,53.88 8.88,58.38 JP2.5
MOSI
  Top 0.406: IC1.16 6.12,42.25 5.38,42.25 2.88,44.75 2.88,55 6.25,58.38 JP2.3
N$1  (via drill 0.3)
  Top 0.406: 28.18,40.12 29.38,40.12 IC1.34
  Top 0.61: 28.18,40.12 25.99,37.93 v25.99,34.13
  Bottom 0.406: 22.88,25.5 L2.1
  Bottom 0.61: v25.99,34.13 22.88,31.02 22.88,25.5
N$2  (via drill 0.3)
  Top 0.406: v19.05,16.19 9.84,25.4 9.84,26.67 v4.45,32.07
  Bottom 0.406: R7.2 20.25,11.12 20.25,13.5 19.12,14.62 19.05,14.61 v19.05,16.19 | v4.45,32.07 2.86,33.66 2.54,33.66 C21.-
N$3
  Bottom 0.508: L6.2 83.5,54.25 C16.2 83.82,51.75 C20.1
N$4  (via drill 0.3)
  Top 0.406: 29.12,38 IC1.33
  Top 0.61: 29.12,38 28.01,38 v27.38,37.37
  Bottom 0.61: v27.38,37.37 26.52,36.51 22.54,36.51 15.56,29.52 14.29,28.25 13.65,27.61 13.65,26.67 14.92,25.4 L1.1
N$5  (via drill 0.3)
  Top 0.406: v63.88,50.25 59.12,50.25 58.88,50.5 58,50.5 49.62,42.12 49.62,40.75 TR1.P$6
  Bottom 0.406: v63.88,50.25 67.12,50.25 U1.9
N$6
  Bottom 0.508: C19.2 R5.2
N$7
  Bottom 0.406: U1.7 62.25,48.88 61.75,48.38 59.88,48.38 58.5,47 TR1.P$2
N$8
  Top 0.406: U3.4 75.25,34.53 R14.2 75.25,31.43 75.56,31.11 79.06,31.11 R13.1
N$9
  Top 0.406: C30.2 80.38,24.12 80.38,20.75 78.88,19.25 33.5,19.25 27,12.75 27,8.12 R12.S
N$10  (via drill 0.3)
  Top 0.406: v82.12,32.62 82.12,31.22 83.19,30.16 85.18,30.16 85.5,30.48 v85.5,32.62
  Bottom 0.406: R11.2 74.62,28 74.62,30.38 75,30.38 C27.1 75.25,30.5 76.94,32.19 79.56,32.19 80,31.75 | v85.5,32.62 85.62,32.62 85.62,40.62 85.25,41 85,41 83.88,42.12 R6.1 | v82.12,32.62 82,32.5 80.75,32.5 80,31.75 | 80,31.75 79.38,31.12 79.38,30.5 IC2.3
N$11
  Bottom 0.406: R10.2 80.25,24.25 80.25,26.62 80,26.62 C25.1 80.69,26.8 80.69,30.36 IC2.2 80.75,30.5 80.75,31.25 81.38,31.88 86.25,31.88 86.25,42.12 R5.1
N$12
  Bottom 0.508: C18.2 R4.2
N$13
  Bottom 0.406: R3.1 76.25,42.12 76.38,42 79,42 R8.2 78.62,41.88 78.62,39.38 C23.1 78.75,39.25 79.38,39.25 79.38,35.75 IC2.6
N$14
  Top 0.406: C31.2 73.66,28.26 73.66,34.92 73.97,35.23 U3.3 U3.2
N$15
  Bottom 0.508: C17.2 R3.2
N$16
  Bottom 0.406: R4.1 73.75,42.12 73.75,38.25 74.5,38.25 R9.2 74.62,38 74.62,35.62 75,35.62 C24.1 75.25,35.62 78,35.62 IC2.5
N$17
  Top 0.406: C30.1 82.23,26.04 R13.2
N$18
  Bottom 0.508: C5.2 55.88,49.4 55.88,45.72 57.15,44.45 TR1.P$1
N$19
  Bottom 0.508: C20.2 R6.2
N$20
  Bottom 0.508: L4.2 73.34,54.25 C15.2 73.66,51.75 C18.1
N$21
  Bottom 0.406: C28.2 89,24 89,20 J3.5
N$22
  Bottom 0.406: C29.2 83.88,15 88.88,10 J3.2
N$23
  Top 0.508: SJ4.1 SJ2.1 46.99,58.42 48.26,57.15 48.69,56.72 OLED1.GND
N$24
  Top 0.508: 44.19,55.63 SJ1.1 | SJ3.1 43.94,55.38 44.19,55.63 | OLED1.VCC 44.19,55.63
N$25
  Top 0.406: U3.1 73.32,36.53 R15.1
N$26
  Bottom 0.508: L3.2 76.52,54.25 C13.2 76.2,51.75 C17.1
N$27
  Bottom 0.508: L5.2 86.68,54.25 C14.2 86.36,51.75 C19.1
N$28
  Top 0.61: C6.1 40.32,58.42 SJ2.2 SJ1.2 FL1.1
N$29
  Bottom 0.61: FL2.2 66.99,37.21 C8.1 66.99,41.02 U1.16
NF
  Bottom 0.61: C22.2 21.72,5.24 R12.A 21.52,8.02 R7.1
OUT_R
  Top 0.406: 87.25,38.38 82.62,38.38 82.38,38.62 81.28,38.62 81.28,37.47 81.6,37.15 81.6,34.61 79.69,34.61 U3.5 79.64,33.91 79.38,33.66 78.1,33.66 R14.1 | 87.25,38.38 88.88,40 J4.5 | J4.2 88.88,30 88.88,30.5 87.25,32.12 87.25,38.25 87.25,38.38
P_0
  Bottom 0.406: U1.12 67.12,46.38 62.38,46.38 U1.5 62.12,46.25 61.88,46 58,46 57.38,46.62 57.38,48.5 58.88,48.5 62.88,52.5 66.38,52.5 72.38,58.5 72.38,58.88 L4.1
  Bottom 0.508: L4.1 72.07,59.42 C11.2
P_90  (via drill 0.3)
  Top 0.406: v65.62,45.62 64.38,46.88 | 64.38,46.88 v64.12,47.12 | v76.12,57.38 73.88,57.38 65.62,49.12 65.5,49.12 64.5,48.12 64.5,47 64.38,46.88
  Bottom 0.406: v64.12,47.12 62.88,47.12 62.38,47.62 U1.6 | v65.62,45.62 66.12,45.12 67.12,45.12 U1.13 | v76.12,57.38 80.75,57.38 82.38,59 L6.1
  Bottom 0.508: L6.1 82.55,61.91 C12.2
P_180  (via drill 0.3)
  Top 0.406: v60.75,45.25 v63.75,48.25 63.88,48.38 v72.88,57.38
  Bottom 0.406: v60.75,45.25 62.12,45.25 62.25,45.12 U1.4 | v63.75,48.25 64.12,47.88 65.25,47.88 65.5,47.62 67.12,47.62 U1.11 | v72.88,57.38 75.12,57.38 77,59.25 L3.1
  Bottom 0.508: L3.1 77.15,59.42 C9.2
P_270  (via drill 0.3)
  Top 0.406: v65.38,44.38 66.38,45.38 66.38,47.75 | v65.75,48.38 66.38,47.75 | v75.25,56.62 66.5,47.88 66.38,47.75
  Bottom 0.406: v65.38,44.38 62.88,44.38 62.38,43.88 U1.3 | v65.75,48.38 66.25,48.88 67.12,48.88 U1.10 | v75.25,56.62 85.25,56.62 87.5,58.88 L5.1
  Bottom 0.508: L5.1 87.63,61.91 C10.2
PUSH
  Top 0.406: SW1.E 74.25,20.75 65.38,20.75 26.5,59.62 16,59.62 15.25,58.88 15.25,58 16.75,56.5 16.75,54.88 IC1.6
RF_1
  Bottom 0.508: JP4.2 C5.1
RF_2
  Bottom 0.508: TR1.P$4 54.61,50.8 58.42,54.61 JP4.1
RX_I  (via drill 0.3)
  Top 0.406: v84.62,31.12 84.62,35.38 v82.12,37.88 | v26.88,40.13 22.88,36.13 22.88,31.62 IC1.28 | v80,40.25 76.59,40.25 75.56,41.27 65.41,41.27 63.62,39.49 v63.62,39
  Bottom 0.406: R8.1 81,41.88 81,39.38 81.38,39.38 C23.2 | v84.62,31.12 88.88,26.88 C28.1 | C23.2 81.5,39.25 82.12,39.25 v82.12,37.88 82,37.75 80.75,37.75 80.75,35.75 IC2.7 | v26.88,40.13 27.39,40.65 37.12,40.65 40.03,37.73 62.35,37.73 v63.62,39 | v80,40.25 80.88,40.25 C23.2
RX_Q  (via drill 0.3)
  Top 0.406: v19.61,25.51 20.88,26.78 20.88,31.43 IC1.27 | v78.75,20.12 v65,20.12
  Bottom 0.406: 83.75,20.12 83.75,24 82.38,24 R10.1 82.25,24.25 82.25,26.62 82.62,26.62 C25.2 82.12,26.75 82,26.75 82,30.38 IC2.1 | 83.75,20.12 83.75,18 C29.1 | v65,20.12 64.36,20.76 24.32,20.76 19.61,25.48 v19.61,25.51 | v78.75,20.12 83.62,20.12 83.75,20.12
SCK  (via drill 0.3)
  Top 0.406: v3.62,46 5.38,44.25 6.12,44.25 IC1.15
  Bottom 0.406: v3.62,46 2.35,47.27 2.35,60.88 3.75,60.88 JP2.2
SCL  (via drill 0.3)
  Top 0.406: v25.61,44.4 15.46,34.25 6.25,34.25 IC1.20 | v42.38,46.88 51.12,55.62 OLED1.SCL
  Bottom 0.406: v25.61,44.4 26.82,45.6 41.1,45.6 v42.38,46.88
SDA  (via drill 0.3)
  Top 0.406: v25.59,47.29 19.25,47.29 8.21,36.25 6.25,36.25 IC1.19 | v45.62,47.62 53.62,55.62 OLED1.SDA
  Bottom 0.406: v25.59,47.29 25.93,47.62 v45.62,47.62
SPEAKER  (via drill 0.3)
  Top 0.406: v3.88,41.75 5.38,40.25 6.12,40.25 IC1.17
  Bottom 0.406: v3.88,41.75 2.62,41.75 2.62,40 C21.+
VBAT
  Top 0.406: 29.5,36.12 IC1.32 | 11.22,7.75 J1.2
  Top 0.61: 29.5,36.12 33.52,36.12 34.51,35.13 34.51,31.61 30.86,27.95 30.86,19.33 19.28,7.75 11.22,7.75
  Bottom 0.61: J1.2 7.79,11.29 J1.3

### Text on the board
tNames: RF | Speaker | Headphones | OLED | Batt. | Sound-Card | PICO-SDR | DL3AKB